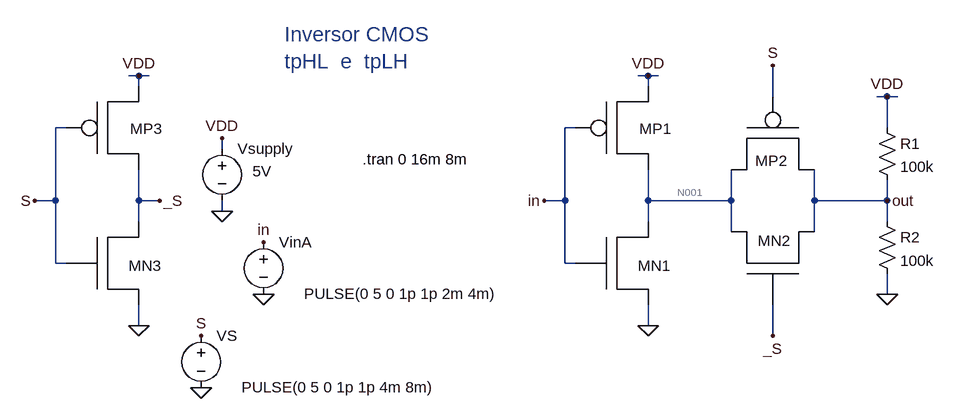
[diagram p0: schematic inverter-tristate.asc]
inverter-tristate.asc, the LTspice schematic file:
Version 4
SHEET 1 2472 680
WIRE -400 -128 -416 -128
WIRE -384 -128 -400 -128
WIRE 384 -128 368 -128
WIRE 400 -128 384 -128
WIRE -400 -112 -400 -128
WIRE 384 -112 384 -128
WIRE 576 -96 576 -144
WIRE 752 -96 736 -96
WIRE 768 -96 752 -96
WIRE -512 -48 -528 -48
WIRE 272 -48 256 -48
WIRE 752 -48 752 -96
WIRE -272 -16 -272 -32
WIRE -528 64 -528 -48
WIRE -528 64 -560 64
WIRE -400 64 -400 16
WIRE -368 64 -400 64
WIRE 256 64 256 -48
WIRE 256 64 224 64
WIRE 384 64 384 16
WIRE 512 64 512 16
WIRE 512 64 384 64
WIRE 640 64 640 16
WIRE 752 64 752 32
WIRE 752 64 640 64
WIRE -272 80 -272 64
WIRE -400 96 -400 64
WIRE 384 96 384 64
WIRE 752 96 752 64
WIRE 512 112 512 64
WIRE 640 112 640 64
WIRE -528 160 -528 64
WIRE -512 160 -528 160
WIRE 256 160 256 64
WIRE 272 160 256 160
WIRE 752 208 752 176
WIRE -400 256 -400 224
WIRE 384 256 384 224
WIRE 576 272 576 224
FLAG -272 80 0
FLAG -208 208 0
FLAG -272 -32 VDD
FLAG -208 128 in
FLAG 384 -128 VDD
FLAG 752 64 out
FLAG 384 256 0
FLAG 224 64 in
FLAG 752 -96 VDD
FLAG 752 208 0
FLAG 576 -144 S
FLAG 576 272 _S
FLAG -400 -128 VDD
FLAG -368 64 _S
FLAG -400 256 0
FLAG -560 64 S
FLAG -304 352 0
FLAG -304 272 S
SYMBOL voltage -272 -32 R0
WINDOW 3 47 51 Left 2
SYMATTR Value 5V
SYMATTR InstName Vsupply
SYMBOL voltage -208 112 R0
WINDOW 123 0 0 Left 2
WINDOW 39 0 0 Left 2
WINDOW 3 62 95 Left 2
SYMATTR Value PULSE(0 5 0 1p 1p 2m 4m)
SYMATTR InstName VinA
SYMBOL PMOSX 352 -64 R0
SYMATTR InstName MP1
SYMBOL NMOSX 352 144 R0
SYMATTR InstName MN1
SYMBOL PMOSX 592 -16 R90
WINDOW 0 3 18 VTop 2
SYMATTR InstName MP2
SYMBOL NMOSX 560 144 R270
WINDOW 0 3 18 VTop 2
SYMATTR InstName MN2
SYMBOL res 736 -64 R0
SYMATTR InstName R1
SYMATTR Value 100k
SYMBOL res 736 80 R0
SYMATTR InstName R2
SYMATTR Value 100k
SYMBOL PMOSX -432 -64 R0
SYMATTR InstName MP3
SYMBOL NMOSX -432 144 R0
SYMATTR InstName MN3
SYMBOL voltage -304 256 R0
WINDOW 123 0 0 Left 2
WINDOW 39 0 0 Left 2
WINDOW 3 62 95 Left 2
SYMATTR Value PULSE(0 5 0 1p 1p 4m 8m)
SYMATTR InstName VS
TEXT -56 0 Left 2 !.tran 0 16m 8m
TEXT -176 -192 Left 3 ;Inversor CMOS\ntpHL  e  tpLH

The netlist it stands for:
* inverter-tristate.asc
Vsupply VDD 0 5V
VinA in 0 PULSE(0 5 0 1p 1p 2m 4m)
XMP1 N001 in VDD PMOSX  ; pins D G S
XMN1 N001 in 0 NMOSX  ; pins D G S
XMP2 N001 S out PMOSX  ; pins D G S
XMN2 N001 _S out NMOSX  ; pins D G S
R1 VDD out 100k
R2 out 0 100k
XMP3 _S S VDD PMOSX  ; pins D G S
XMN3 _S S 0 NMOSX  ; pins D G S
VS S 0 PULSE(0 5 0 1p 1p 4m 8m)
.tran 0 16m 8m
* Inversor CMOS
* tpHL  e  tpLH
.lib MOS4007.txt
.backanno
.end

* Results of the author's LTspice run, read from the files saved beside the schematic
* Operating Point, zero values left out:
*   V(vdd) = 5 V
*   V(n001) = 4.953 V
*   V(out) = 4.904 V
*   V(_s) = 5 V
*   I(R2) = 49.04 µA
*   I(R1) = 960.4 nA
*   I(Vsupply) = -49.04 µA
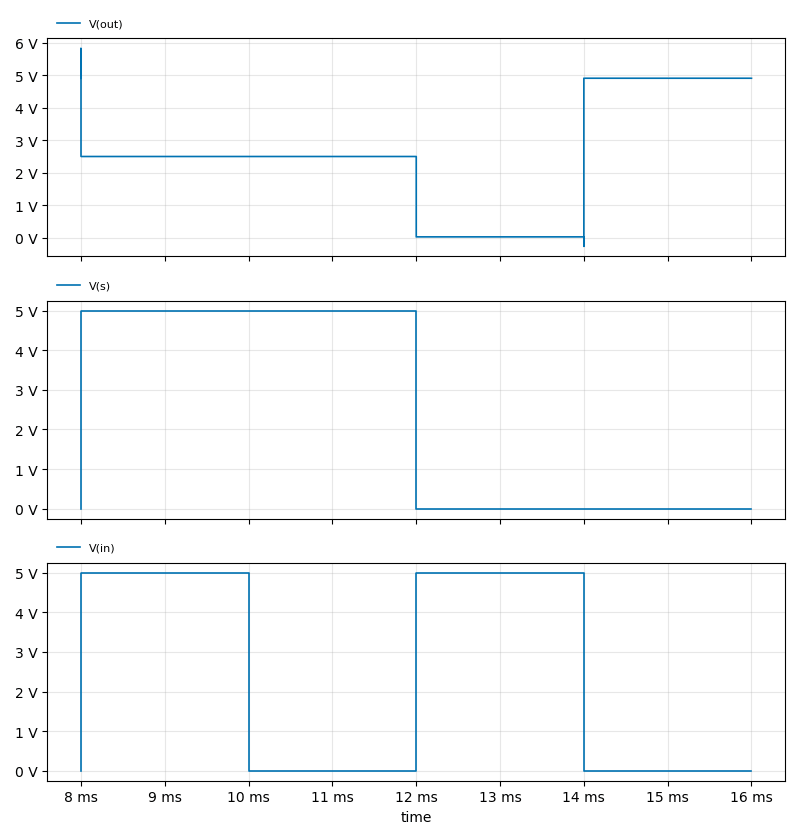
[diagram p1: Transient Analysis of inverter-tristate.asc, plotted from the saved traces]
* Transient Analysis, 1 run:
*   V(out): min -262.1 mV, max 5.822 V, average 2.484 V, rms 3.023 V, last 4.904 V
*   V(s): min 0 V, max 5 V, average 2.5 V, rms 3.536 V, last 0 V
*   V(in): min 0 V, max 5 V, average 2.5 V, rms 3.536 V, last 0 V